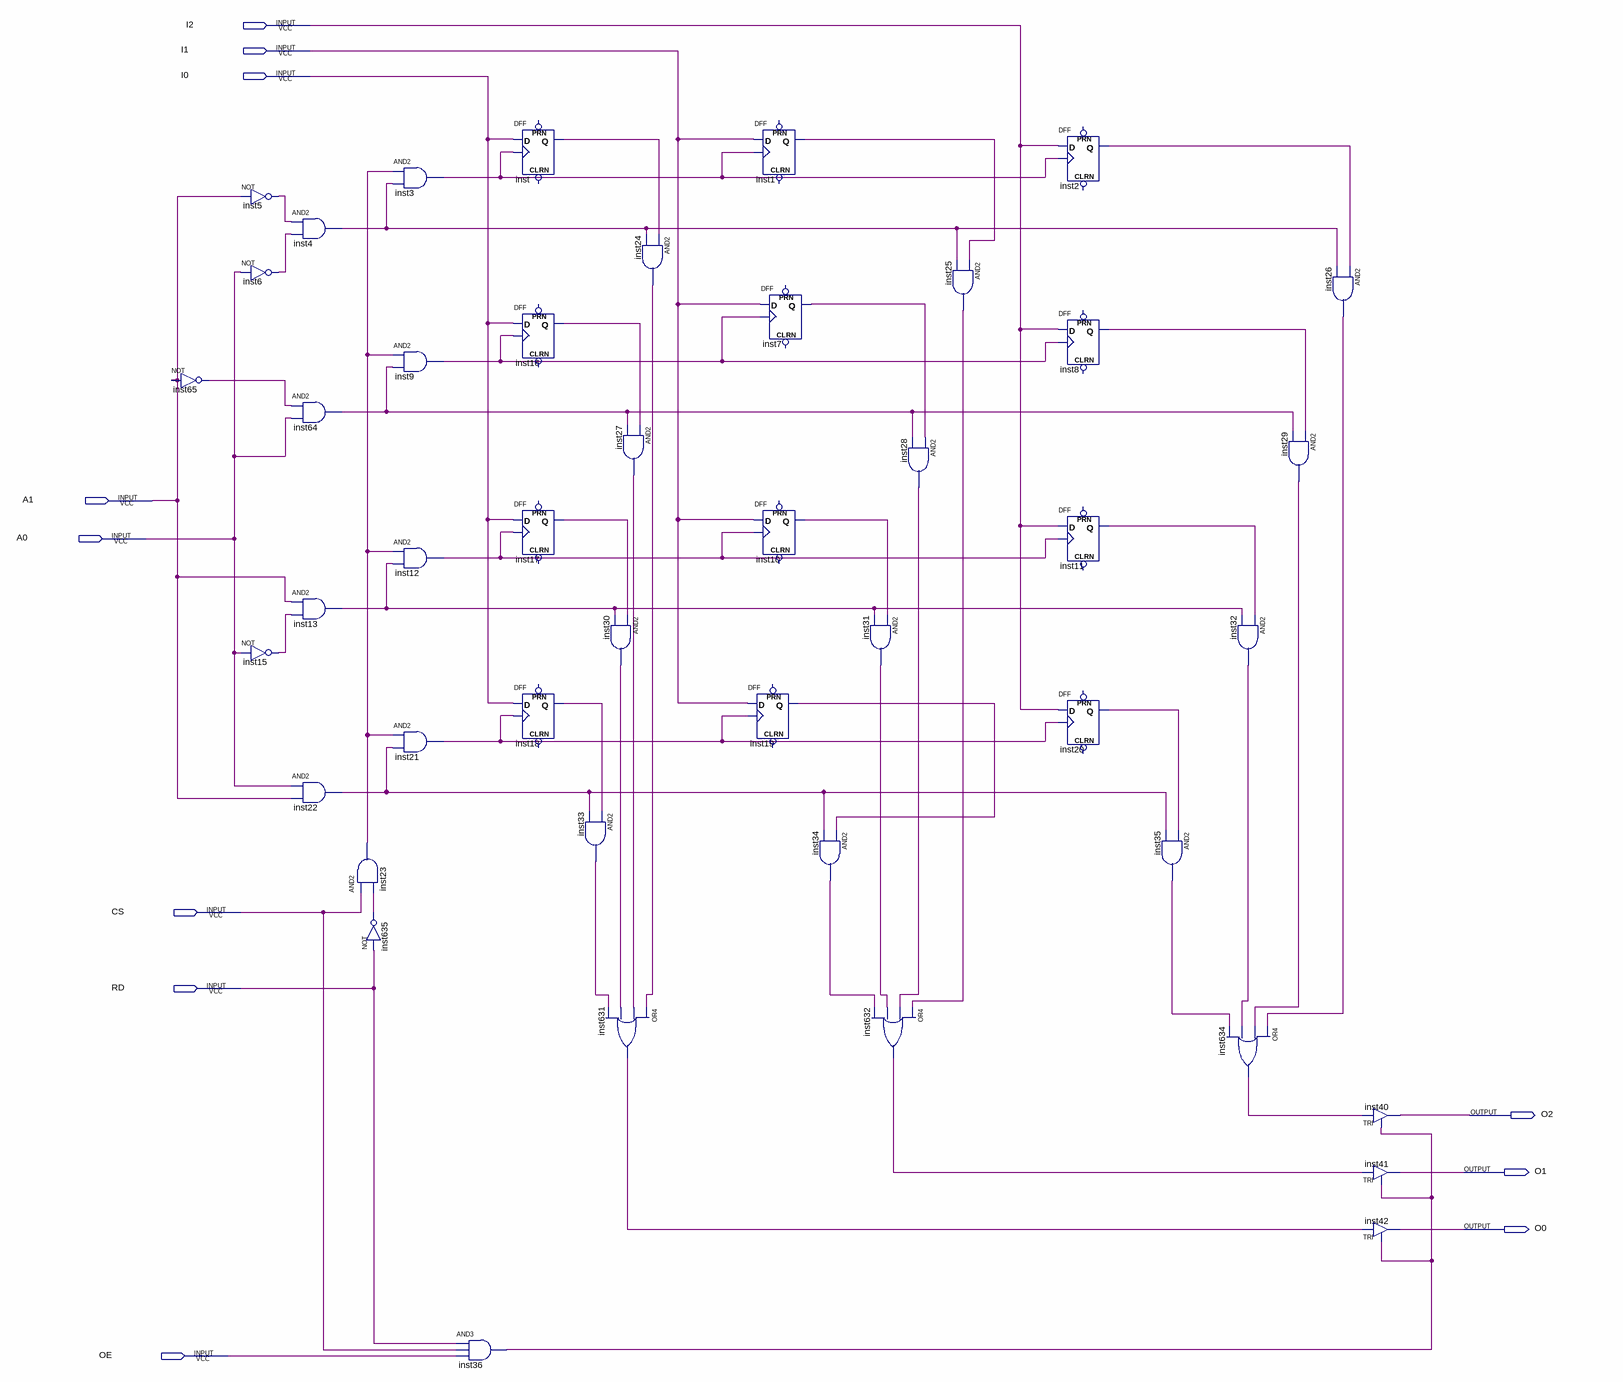
[diagram p0: schematic sheet]
// Quartus schematic MEMORY.bdf as structural Verilog: 45 symbols, 11 pins
module MEMORY (
  input  I2,
  input  I1,
  input  I0,
  input  A1,
  input  A0,
  input  CS,
  input  RD,
  input  OE,
  output O2,
  output O1,
  output O0
);

  wire inst1_q, inst2_q, inst3_out, inst4_out, inst5_out, inst6_out, inst7_q, inst8_q, inst9_out, inst10_q,
       inst11_q, inst12_out, inst13_out, inst15_out, inst16_q, inst17_q, inst18_q, inst19_q, inst20_q,
       inst21_out, inst22_out, inst23_out, inst24_out, inst25_out, inst26_out, inst27_out, inst28_out,
       inst29_out, inst30_out, inst31_out, inst32_out, inst33_out, inst34_out, inst35_out, inst36_out,
       inst64_out, inst65_out, inst631_out, inst632_out, inst634_out, inst635_out, inst_q;

  not inst65 (inst65_out, A1);
  not inst5 (inst5_out, A1);
  not inst6 (inst6_out, A0);
  not inst15 (inst15_out, A0);
  and inst4 (inst4_out, inst5_out, inst6_out);
  and inst64 (inst64_out, inst65_out, A0);
  and inst13 (inst13_out, A1, inst15_out);
  and inst22 (inst22_out, A0, A1);
  and inst23 (inst23_out, CS, inst635_out);
  not inst635 (inst635_out, RD);
  and inst3 (inst3_out, inst23_out, inst4_out);
  and inst9 (inst9_out, inst23_out, inst64_out);
  and inst12 (inst12_out, inst23_out, inst13_out);
  and inst21 (inst21_out, inst23_out, inst22_out);
  and inst36 (inst36_out, RD, CS, OE);
  DFF inst (.CLK(inst3_out), .D(I0), .Q(inst_q));  // open: CLRN, PRN
  DFF inst16 (.CLK(inst9_out), .D(I0), .Q(inst16_q));  // open: CLRN, PRN
  DFF inst17 (.CLK(inst12_out), .D(I0), .Q(inst17_q));  // open: CLRN, PRN
  DFF inst18 (.CLK(inst21_out), .D(I0), .Q(inst18_q));  // open: CLRN, PRN
  and inst27 (inst27_out, inst16_q, inst64_out);
  and inst30 (inst30_out, inst17_q, inst13_out);
  and inst33 (inst33_out, inst18_q, inst22_out);
  or inst631 (inst631_out, inst24_out, inst27_out, inst30_out, inst33_out);
  and inst24 (inst24_out, inst_q, inst4_out);
  DFF inst1 (.CLK(inst3_out), .D(I1), .Q(inst1_q));  // open: CLRN, PRN
  DFF inst7 (.CLK(inst9_out), .D(I1), .Q(inst7_q));  // open: CLRN, PRN
  DFF inst10 (.CLK(inst12_out), .D(I1), .Q(inst10_q));  // open: CLRN, PRN
  DFF inst19 (.CLK(inst21_out), .D(I1), .Q(inst19_q));  // open: CLRN, PRN
  and inst34 (inst34_out, inst19_q, inst22_out);
  and inst31 (inst31_out, inst10_q, inst13_out);
  or inst632 (inst632_out, inst25_out, inst28_out, inst31_out, inst34_out);
  and inst28 (inst28_out, inst7_q, inst64_out);
  and inst25 (inst25_out, inst1_q, inst4_out);
  DFF inst2 (.CLK(inst3_out), .D(I2), .Q(inst2_q));  // open: CLRN, PRN
  DFF inst8 (.CLK(inst9_out), .D(I2), .Q(inst8_q));  // open: CLRN, PRN
  DFF inst11 (.CLK(inst12_out), .D(I2), .Q(inst11_q));  // open: CLRN, PRN
  DFF inst20 (.CLK(inst21_out), .D(I2), .Q(inst20_q));  // open: CLRN, PRN
  and inst35 (inst35_out, inst20_q, inst22_out);
  or inst634 (inst634_out, inst26_out, inst29_out, inst32_out, inst35_out);
  and inst32 (inst32_out, inst11_q, inst13_out);
  and inst26 (inst26_out, inst2_q, inst4_out);
  and inst29 (inst29_out, inst8_q, inst64_out);
  TRI inst40 (.IN(inst634_out), .OE(inst36_out), .OUT(O2));
  TRI inst41 (.IN(inst632_out), .OE(inst36_out), .OUT(O1));
  TRI inst42 (.IN(inst631_out), .OE(inst36_out), .OUT(O0));
endmodule
